# Altium schematic sheet Input.SchDoc
size A4; SheetNumber: 6; SheetTotal: 7
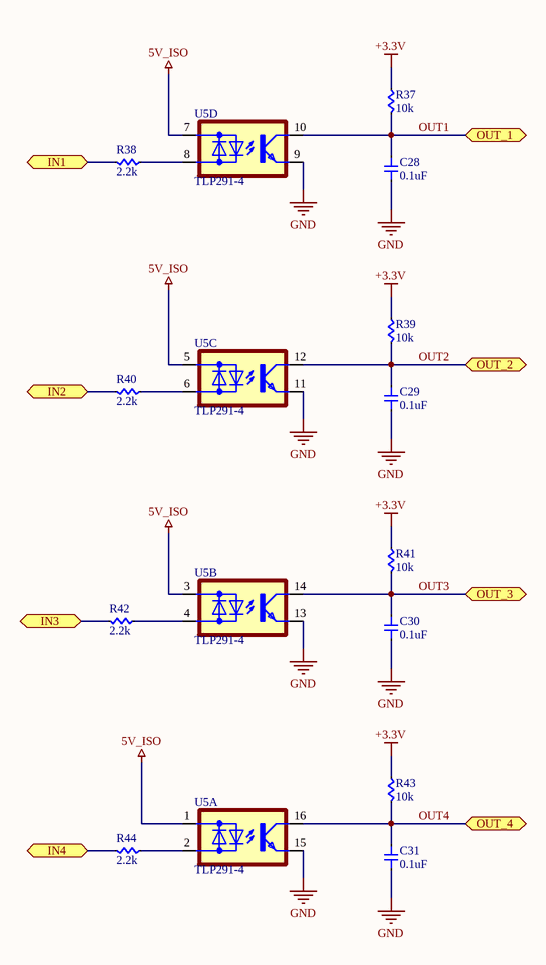
[diagram p0: Input.SchDoc]

## Parts
C28  0.1uF  [Cap 0603]
C29  0.1uF  [Cap 0603]
C30  0.1uF  [Cap 0603]
C31  0.1uF  [Cap 0603]
R37  10k  [RES 0603]
R38  2.2k  [RES 0603]
R39  10k  [RES 0603]
R40  2.2k  [RES 0603]
R41  10k  [RES 0603]
R42  2.2k  [RES 0603]
R43  10k  [RES 0603]
R44  2.2k  [RES 0603]
U5  TLP291-4  [SOP16_TLP2xx]  (parts A,B,C,D of 4)

## Ports
IN1 (bidir), IN2 (bidir), IN3 (bidir), IN4 (bidir), OUT_1 (bidir), OUT_2 (bidir), OUT_3 (bidir), OUT_4 (bidir)

## Nets
5V_ISO: U5.1(AC1) U5.3(AC1) U5.5(AC1) U5.7(AC1)
+3.3V: R37.1 R39.1 R41.1 R43.1
GND: C28.2 C29.2 C30.2 C31.2 U5.9(E) U5.11(E) U5.13(E) U5.15(E)
IN1: R38.2 ; port IN1
IN2: R40.2 ; port IN2
IN3: R42.2 ; port IN3
IN4: R44.2 ; port IN4
OUT1: C28.1 R37.2 U5.10(C) ; port OUT_1
OUT2: C29.1 R39.2 U5.12(C) ; port OUT_2
OUT3: C30.1 R41.2 U5.14(C) ; port OUT_3
OUT4: C31.1 R43.2 U5.16(C) ; port OUT_4
NetR38_1: R38.1 U5.8(AC2)
NetR40_1: R40.1 U5.6(AC2)
NetR42_1: R42.1 U5.4(AC2)
NetR44_1: R44.1 U5.2(AC2)

## Library data of the parts
C28-C31 = Cap 0603: Capacitor SMD 0603
R37 R39 R41 R43 = RES 0603: RES SMD 0603; Manufacturer: Vishay Dale; Manufacturer Part Number: CRCW040210K0FKED; Tolerance: ±1%; Power (Watts): 0.063W, 1/16W; Temperature Coefficient: ±100ppm/°C; Supplier 1: Digi-Key; RoHS: RoHS Compliant; Category: Resistors; Stock 1: 2392462; Pricing 1: 10=0.083, 50=0.0444, 200=0.0255, 1000=0.0174 (USD); Packaging: Cut Tape (CT); Resistance (Ohms): 10k; Composition: Thick Film; Features: Automotive AEC-Q200; Operating Temperature: -55°C ~ 155°C; Package / Case: 0402 (1005 Metric); Supplier Device Package: 0402 (1005 Metric); Size / Dimension: 0.039" L x 0.020" W (1.00mm x 0.50mm); Height: 0.016" (0.40mm); Number of Terminations: 2; ComponentLink1URL: http://www.vishay.com/docs/20035/dcrcwe3.pdf; ComponentLink1Description: http://www.vishay.com/docs/20035/dcrcwe3.pdf; Supplier Part Number 1: 541-10.0KLCT-ND
R38 R40 R42 R44 = RES 0603: RES SMD 0603; Manufacturer: Vishay Dale; Manufacturer Part Number: CRCW040210K0FKED; Resistance (Ohms): 10k; Tolerance: ±1%; Power (Watts): 0.063W, 1/16W; Temperature Coefficient: ±100ppm/°C; Supplier 1: Digi-Key; RoHS: RoHS Compliant; Category: Resistors; Stock 1: 2392462; Pricing 1: 10=0.083, 50=0.0444, 200=0.0255, 1000=0.0174 (USD); Packaging: Cut Tape (CT); Composition: Thick Film; Features: Automotive AEC-Q200; Operating Temperature: -55°C ~ 155°C; Package / Case: 0402 (1005 Metric); Supplier Device Package: 0402 (1005 Metric); Size / Dimension: 0.039" L x 0.020" W (1.00mm x 0.50mm); Height: 0.016" (0.40mm); Number of Terminations: 2; ComponentLink1URL: http://www.vishay.com/docs/20035/dcrcwe3.pdf; ComponentLink1Description: http://www.vishay.com/docs/20035/dcrcwe3.pdf; Supplier Part Number 1: 541-10.0KLCT-ND
U5 = OPTO TLP291-4: Optoisolator Transistor Output 2500Vrms 4 Channel 16-SOP; MF: Toshiba Semiconductor; MP: TLP 280-4; SnapEDA_Link: https://www.snapeda.com/parts/TLP%20280-4/Toshiba/view-part/?ref=snap; Package: SOP-16 Toshiba; Value: *; Check_prices: https://www.snapeda.com/parts/TLP%20280-4/Toshiba/view-part/?ref=eda